# EAGLE schematic relay driver (EAGLE 6.5.0)
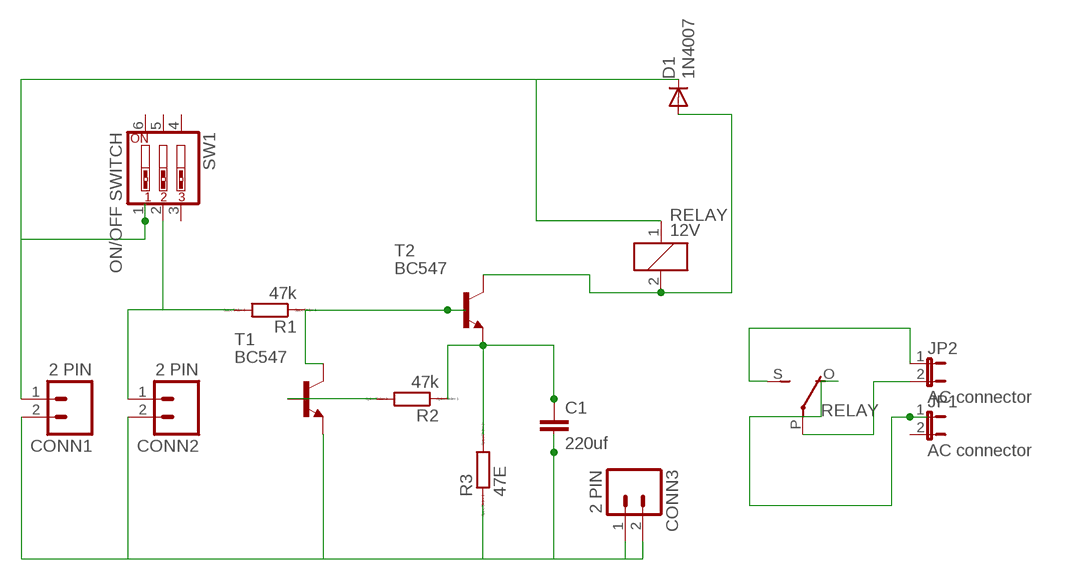
[diagram p0: schematic, sheet 1]

## Parts
C1  220uf  C2.5/5  [C2.5-5]
CONN1  2 PIN  M02  [02P]
CONN2  2 PIN  M02  [02P]
CONN3  2 PIN  M02  [02P]
D1  1N4007  1N4004  [DO41-10]
JP1  AC connector  JP1E  [JP1]
JP2  AC connector  JP1E  [JP1]
R1  47k  R0204/7  [0204/7]
R2  47k  R0204/7  [0204/7]
R3  47E  R0204/7  [0204/7]
RELAY  12V  G5L  [G5LE]
SW1  ON/OFF SWITCH  SW_DIP-3  [EDG-03]
T1  BC547  [TO92]
T2  BC547  [TO92]

## Nets
N$1: R2.2 T1.2(B)
N$2: C1.1 R2.1 R3.2 T2.1(E)
N$3: R1.1 T1.3(C) T2.2(B)
N$4: C1.2 CONN1.2 CONN2.2 CONN3.1 CONN3.2 R3.1 T1.1(E)
N$5: D1.A RELAY.2 T2.3(C)
N$6: JP2.1 RELAY.S(2:S)
N$7: CONN2.1 R1.2 SW1.2
N$8: CONN1.1 D1.C RELAY.1 SW1.1
N$9: JP2.2 RELAY.P(2:P)
N$10: JP1.1 RELAY.O(2:O)
Unconnected: JP1.2 SW1.3 SW1.4 SW1.5 SW1.6

## Library data of the parts
C1 = capacitor-wima:C: CAPACITOR naming: grid - package width
CONN1-CONN3 = con-amp-quick:M02: AMP QUICK CONNECTOR; OC_FARNELL: unknown; OC_NEWARK: unknown
D1 = diode:1N4004: DIODE general purpose rectifier, 1 A
JP1 JP2 = jumper:JP1E: JUMPER
R1-R3 = eagle-ltspice:R: RESISTOR, European symbol; SPICEMODEL: NONE; SPICEPREFIX: R
RELAY = relay:G5L: RELAY 1 x switch, 10 A/120 V AC, 8 A/30 V ADC, Omron; OC_FARNELL: unknown; OC_NEWARK: unknown
SW1 = special:SW_DIP-3: DIP SWITCH
T1 T2 = transistor:BC547: NPN TRANSISTOR